# Altium project LoRa_Core.PrjPcb
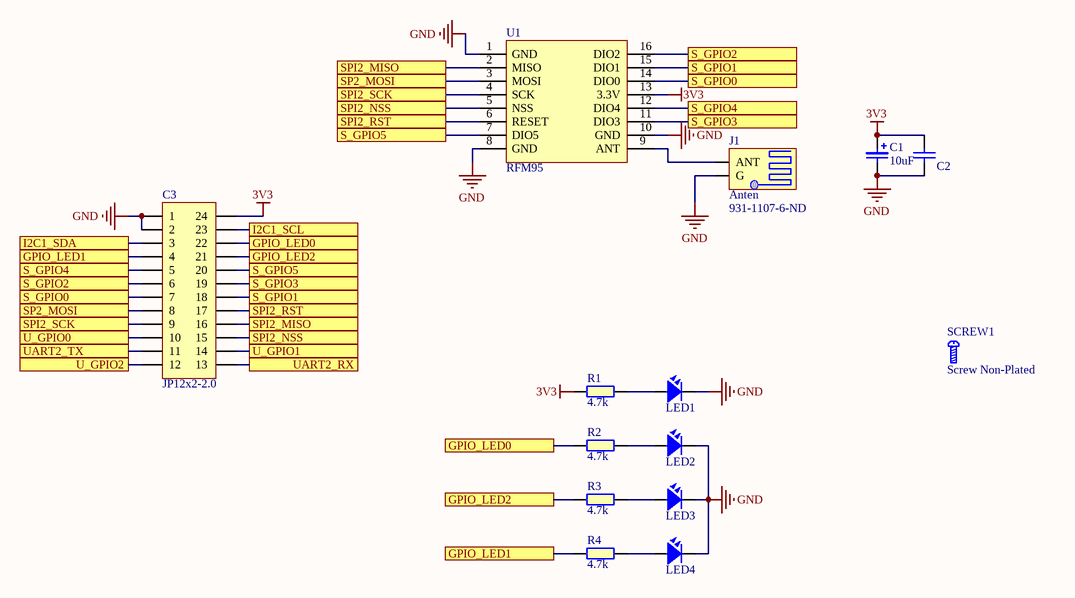
[diagram p0: LoRa.SchDoc]
1 sheet, 14 parts. Net scope: flat (ports and power ports of the same name join across sheets).
Board file: LoRa.PcbDoc

## Sheet LoRa.SchDoc
size A4; Organization: Altium Limited; Address1: L3, 12a Rodborough Rd; Address2: Frenchs Forest; Address3: NSW; Address4: Australia 2086

### Parts
C1  10uF  [CASE A]
C2  0.01uF  [C_0603]  (value not drawn)
C3  JP12x2-2.0  [J12-C2T]
J1  Anten  Supplier Part Number 1: 931-1107-6-ND  [ANTEN_IPEX]
LED1  LED  [LED-3MM-RED]  (value not drawn)
LED2  LED  [LED-3MM-GREEN]  (value not drawn)
LED3  LED  [LED-3MM-BLUE]  (value not drawn)
LED4  LED  [LED-3MM-YELLOW]  (value not drawn)
R1  4.7k  [R_0603]
R2  4.7k  [R_0603]
R3  4.7k  [R_0603]
R4  4.7k  [R_0603]
SCREW1  Screw Non-Plated  [SCREW_NON-PLATED_2MM]
U1  RFM95  [RFM95]

### Ports
GPIO_LED0, GPIO_LED1, GPIO_LED2, I2C1_SCL, I2C1_SDA, S_GPIO0, S_GPIO1, S_GPIO2, S_GPIO3, S_GPIO4, S_GPIO5, SP2_MOSI, SPI2_MISO, SPI2_NSS, SPI2_RST, SPI2_SCK, U_GPIO0, U_GPIO1, U_GPIO2, UART2_RX, UART2_TX

### Nets
3V3: C1.A C2.2 C3.24 R1.1 U1.13(3.3V)
GND: C1.K C2.1 C3.1 C3.2 J1.2(G) LED1.2 LED2.2 LED3.2 LED4.2 U1.1(GND) U1.8(GND) U1.10(GND)
NetC3_3: C3.3 ; port I2C1_SDA
NetC3_4: C3.4 R4.1 ; port GPIO_LED1
NetC3_5: C3.5 U1.12(DIO4) ; port S_GPIO4
NetC3_6: C3.6 U1.16(DIO2) ; port S_GPIO2
NetC3_7: C3.7 U1.14(DIO0) ; port S_GPIO0
NetC3_8: C3.8 U1.3(MOSI) ; port SP2_MOSI
NetC3_9: C3.9 U1.4(SCK) ; port SPI2_SCK
NetC3_10: C3.10 ; port U_GPIO0
NetC3_11: C3.11 ; port UART2_TX
NetC3_12: C3.12 ; port U_GPIO2
NetC3_13: C3.13 ; port UART2_RX
NetC3_14: C3.14 ; port U_GPIO1
NetC3_15: C3.15 U1.5(NSS) ; port SPI2_NSS
NetC3_16: C3.16 U1.2(MISO) ; port SPI2_MISO
NetC3_17: C3.17 U1.6(RESET) ; port SPI2_RST
NetC3_18: C3.18 U1.15(DIO1) ; port S_GPIO1
NetC3_19: C3.19 U1.11(DIO3) ; port S_GPIO3
NetC3_20: C3.20 U1.7(DIO5) ; port S_GPIO5
NetC3_21: C3.21 R3.1 ; port GPIO_LED2
NetC3_22: C3.22 R2.1 ; port GPIO_LED0
NetC3_23: C3.23 ; port I2C1_SCL
NetJ1_1: J1.1(ANT) U1.9(ANT)
NetLED1_1: LED1.1 R1.2
NetLED2_1: LED2.1 R2.2
NetLED3_1: LED3.1 R3.2
NetLED4_1: LED4.1 R4.2

### Notes on the sheet
- Title
- Size:
- Date:
- A4
- Number:
- Time:
- Revision:
- Sheet
- of
- File:

### Library data of the parts
C1 = Capacitor-Tantalium: CAP TANT 10UF 16V 10% 2917; Part Number: T491A106K010AT; Part Description: CAP TANT 10UF 10V 10% 1206; Manufacturer: KEMET; ID: 3; Voltage: 10VDC; Tolerance: 20%; Component Kind: Standard; Component Type: Standard; Pin Count: 2; Status: Not Recommended; Manufacturer Part Number: T491A106K010AT; Case: A CASE; Mounted: Yes; Socket: No; SMD: Yes; ComponentHeigh: https://www.mouser.vn; Manufacturer1 Example: MDBK; Value: 10uF
C2 = CAP_0603
C3 = JP12x2-2.0: WR-PHD 2.00 mm Dual Pin Header; Manufacturer: W¨¹rth Elektronik eiSos GmbH; partNo: 62002421121; ComponentLink1 Description: Manufacturer; ComponentLink2 Description: Datasheet; NoPins: 24; System: Connector; Created Date: 2 April 2013; ComponentLink1URL: http://www.we-online.com; ComponentLink2URL: http://katalog.we-online.de/em/datasheet/6200xx21121.pdf; Created by: Karrer Zheng
J1 = ANTEN_IPEX: CONN UMC RCPT STR 50 OHM SMD; Manufacturer: Taoglas; Manufacturer Part Number: RECE.20279.001E.01; Connector Type: Coaxial,Male Pin; Body Material: Brass; Body Plating: Gold; Gender: Male; Supplier 1: Digi-Key; Stock 1: 45630; Pricing 1: 1=0.75 (USD); Packaging: Tape and Reel; Fastening Type: Snap; Housing Color: White; Mount: Surface Mount; Case/Package: SMD/SMT; Contact Material: Brass; Contact Plating: Gold; Package Quantity: 1; Termination: Solder; Orientation: Straight
LED1-LED4 = LED: LED Single colour Green and Red; Value: LED 3 ly Single Colour
R1-R4 = RES_0603
SCREW1 = SCREW_NON-PLATED
U1 = RFM95: RFM95 ULTRA-LONG RANGE TRANSCEIV; Manufacturer: Seeed Studio; Manufacturer Part Number: 109990166; Stock 1: 0; Pricing 1: 1=7.09 (USD); Supplier 1: Digi-Key; Supplier Part Number 1: 1597-1488-ND